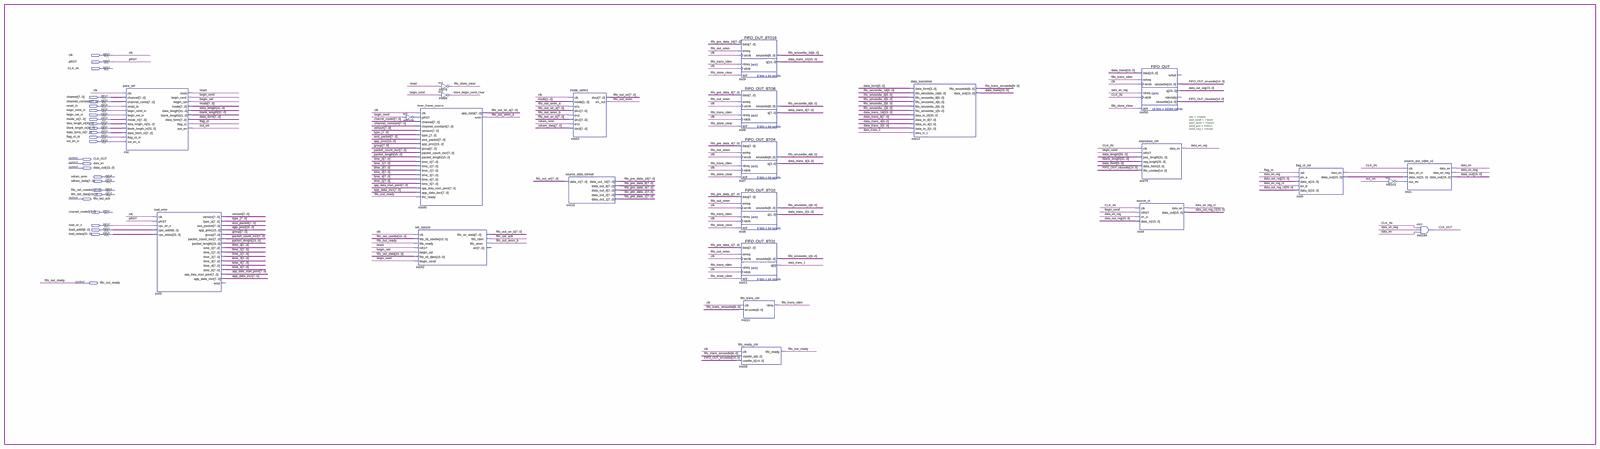
[diagram p0: schematic sheet, whole]
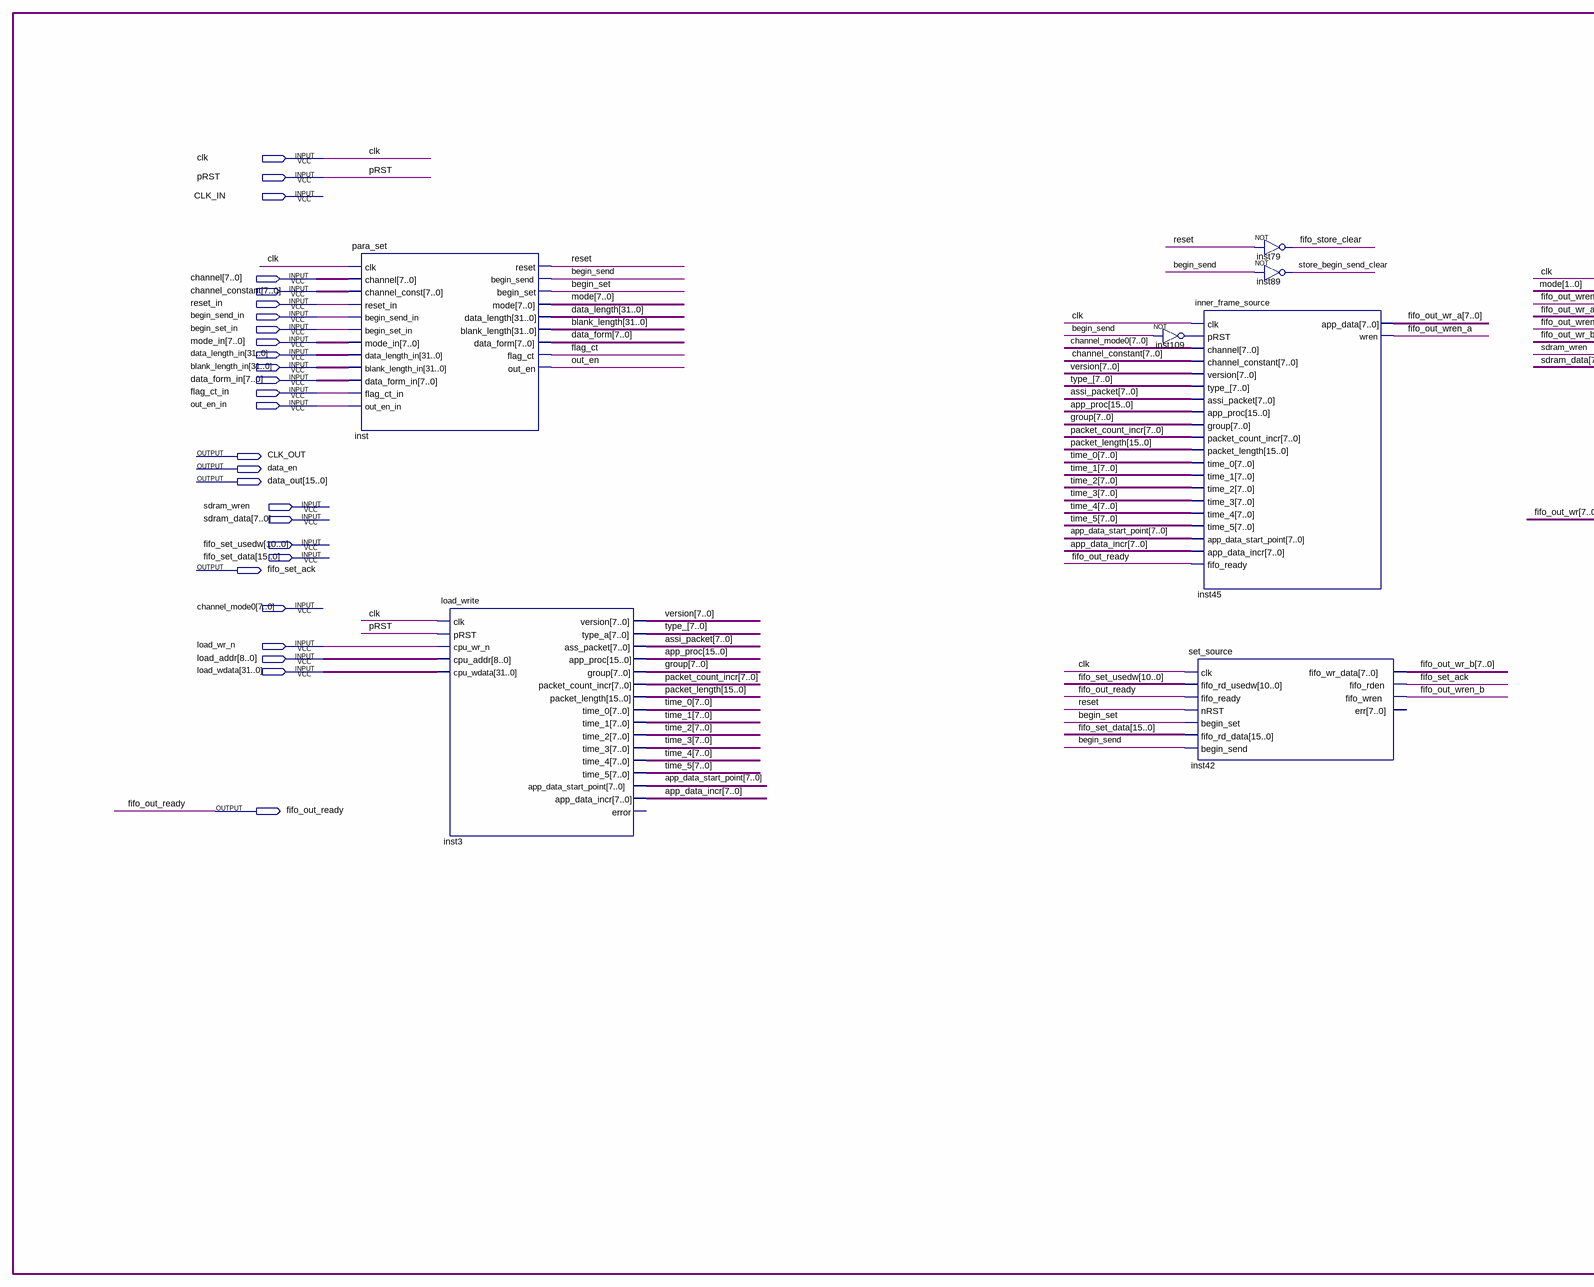
[diagram p1: schematic sheet, left part]
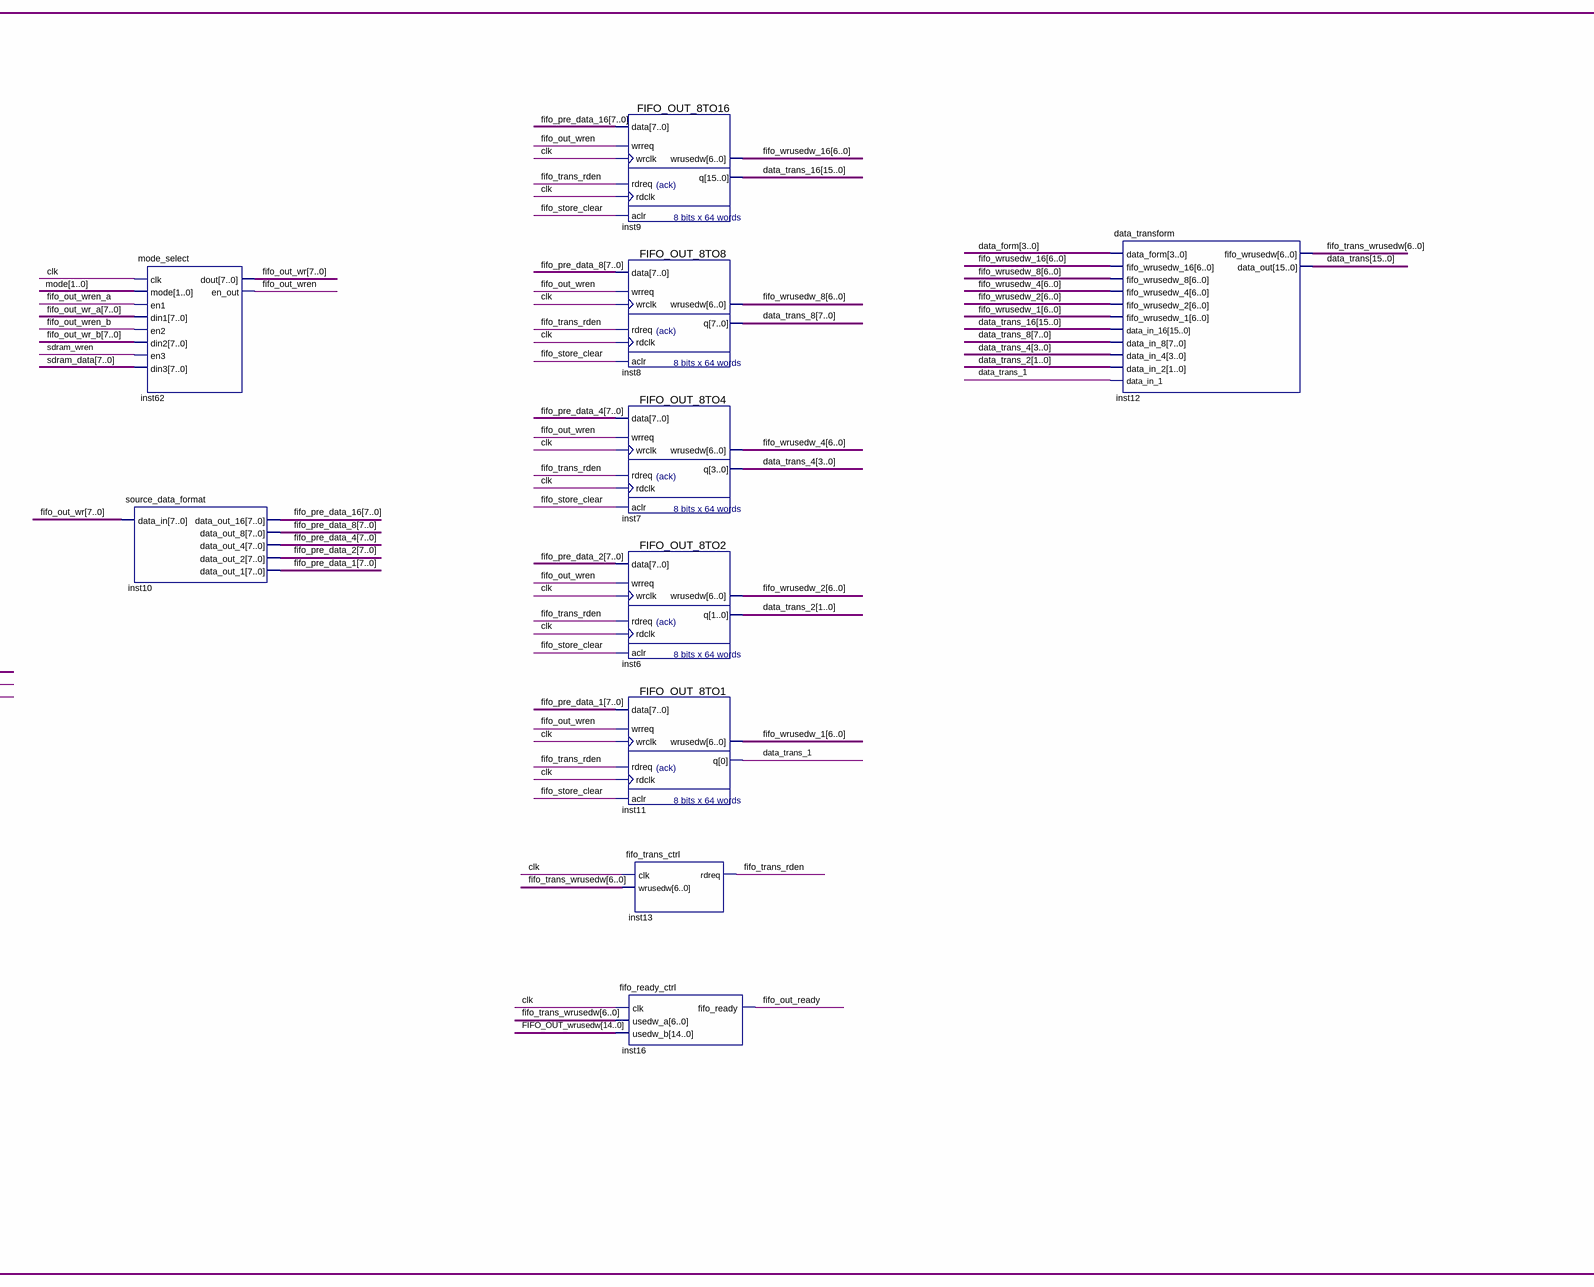
[diagram p2: schematic sheet, centre part]
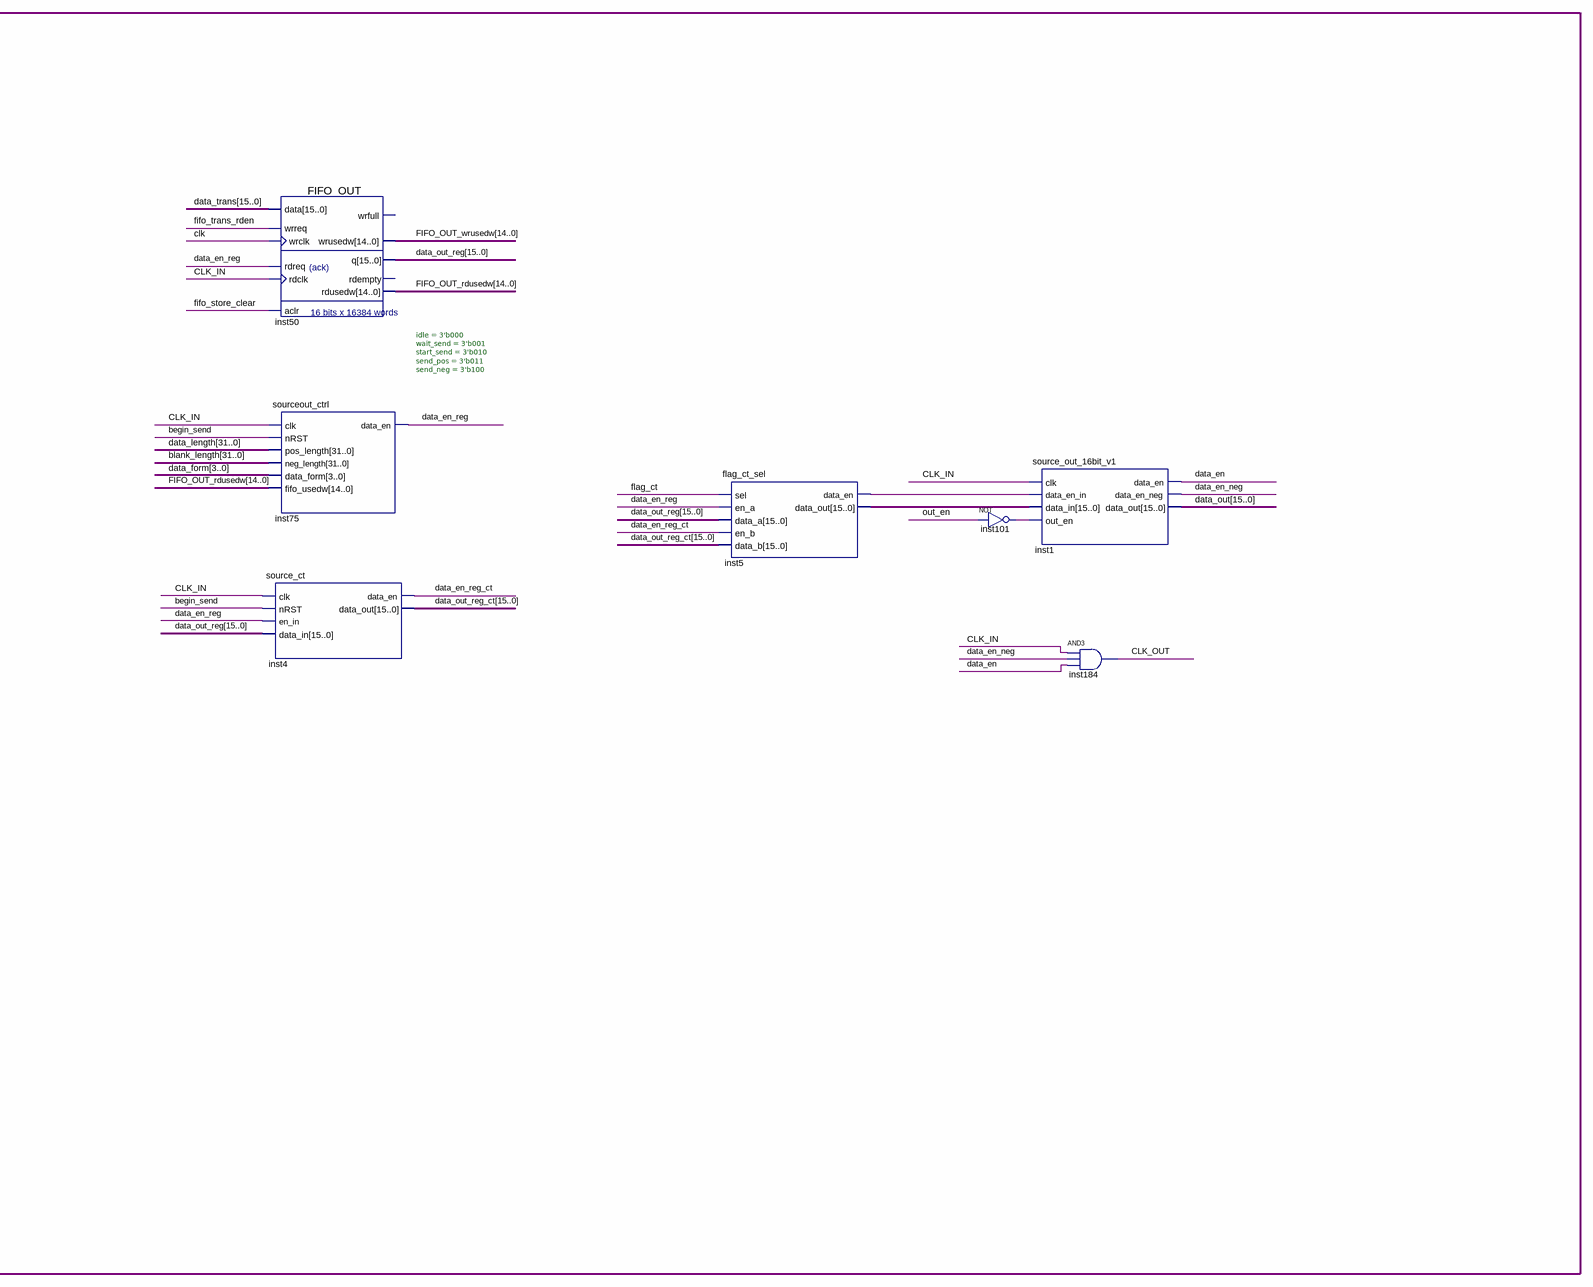
[diagram p3: schematic sheet, right part]
// Quartus schematic data_source_v1.bdf as structural Verilog: 24 symbols, 27 pins
module data_source_v1 (
  input  clk,
  input  pRST,
  input  CLK_IN,
  input  [7:0] channel,
  input  [7:0] channel_constant,
  input  reset_in,
  input  begin_send_in,
  input  begin_set_in,
  input  [7:0] mode_in,
  input  [31:0] data_length_in,
  input  [31:0] blank_length_in,
  input  [7:0] data_form_in,
  input  flag_ct_in,
  input  out_en_in,
  input  sdram_wren,
  input  [7:0] sdram_data,
  input  [10:0] fifo_set_usedw,
  input  [15:0] fifo_set_data,
  input  [7:0] channel_mode0,
  input  load_wr_n,
  input  [8:0] load_addr,
  input  [31:0] load_wdata,
  output CLK_OUT,
  output data_en,
  output [15:0] data_out,
  output fifo_set_ack,
  output fifo_out_ready
);

  wire begin_send, begin_set, data_en_neg, data_en_reg, data_en_reg_ct, data_trans_1, fifo_out_wren,
       fifo_out_wren_a, fifo_out_wren_b, fifo_store_clear, fifo_trans_rden, flag_ct, inst5_data_en,
       inst101_out, inst109_out, out_en, reset, store_begin_send_clear;
  wire [1:0] data_trans_2;
  wire [3:0] data_trans_4;
  wire [6:0] fifo_trans_wrusedw, fifo_wrusedw_1, fifo_wrusedw_2, fifo_wrusedw_4, fifo_wrusedw_8,
       fifo_wrusedw_16;
  wire [7:0] app_data_incr, app_data_start_point, assi_packet, data_form, data_trans_8, fifo_out_wr,
       fifo_out_wr_a, fifo_out_wr_b, fifo_pre_data_1, fifo_pre_data_2, fifo_pre_data_4, fifo_pre_data_8,
       fifo_pre_data_16, group, mode, packet_count_incr, time_0, time_1, time_2, time_3, time_4, time_5,
       type_, version;
  wire [14:0] FIFO_OUT_rdusedw, FIFO_OUT_wrusedw;
  wire [15:0] app_proc, data_out_reg, data_out_reg_ct, data_trans, data_trans_16, inst5_data_out,
       packet_length;
  wire [31:0] blank_length, data_length;

  para_set inst (
    .clk(clk), .channel(channel), .channel_const(channel_constant), .reset_in(reset_in),
    .begin_send_in(begin_send_in), .begin_set_in(begin_set_in), .mode_in(mode_in),
    .data_length_in(data_length_in), .blank_length_in(blank_length_in), .data_form_in(data_form_in),
    .flag_ct_in(flag_ct_in), .out_en_in(out_en_in), .reset(reset), .begin_send(begin_send),
    .begin_set(begin_set), .mode(mode), .data_length(data_length), .blank_length(blank_length),
    .data_form(data_form), .flag_ct(flag_ct), .out_en(out_en));
  load_write inst3 (
    .clk(clk), .pRST(pRST), .cpu_wr_n(load_wr_n), .cpu_addr(load_addr), .cpu_wdata(load_wdata),
    .version(version), .type_a(type_), .ass_packet(assi_packet), .app_proc(app_proc), .group(group),
    .packet_count_incr(packet_count_incr), .packet_length(packet_length), .time_0(time_0), .time_1(time_1),
    .time_2(time_2), .time_3(time_3), .time_4(time_4), .time_5(time_5),
    .app_data_start_point(app_data_start_point), .app_data_incr(app_data_incr));  // open: error
  not inst109 (inst109_out, begin_send);
  inner_frame_source inst45 (
    .clk(clk), .pRST(inst109_out), .channel(channel_mode0), .channel_constant(channel_constant),
    .version(version), .type_(type_), .assi_packet(assi_packet), .app_proc(app_proc), .group(group),
    .packet_count_incr(packet_count_incr), .packet_length(packet_length), .time_0(time_0), .time_1(time_1),
    .time_2(time_2), .time_3(time_3), .time_4(time_4), .time_5(time_5),
    .app_data_start_point(app_data_start_point), .app_data_incr(app_data_incr), .fifo_ready(fifo_out_ready),
    .app_data(fifo_out_wr_a), .wren(fifo_out_wren_a));
  set_source inst42 (
    .clk(clk), .fifo_rd_usedw(fifo_set_usedw), .fifo_ready(fifo_out_ready), .nRST(reset),
    .begin_set(begin_set), .fifo_rd_data(fifo_set_data), .begin_send(begin_send),
    .fifo_wr_data(fifo_out_wr_b), .fifo_rden(fifo_set_ack), .fifo_wren(fifo_out_wren_b));  // open: err
  not inst79 (fifo_store_clear, reset);
  not inst89 (store_begin_send_clear, begin_send);
  source_data_format inst10 (
    .data_in(fifo_out_wr), .data_out_16(fifo_pre_data_16), .data_out_8(fifo_pre_data_8),
    .data_out_4(fifo_pre_data_4), .data_out_2(fifo_pre_data_2), .data_out_1(fifo_pre_data_1));
  mode_select inst62 (
    .clk(clk), .mode(mode[1:0]), .en1(fifo_out_wren_a), .din1(fifo_out_wr_a), .en2(fifo_out_wren_b),
    .din2(fifo_out_wr_b), .en3(sdram_wren), .din3(sdram_data), .dout(fifo_out_wr), .en_out(fifo_out_wren));
  FIFO_OUT_8TO16 inst9 (
    .data(fifo_pre_data_16), .wrreq(fifo_out_wren), .wrclk(clk), .rdreq(fifo_trans_rden), .rdclk(clk),
    .aclr(fifo_store_clear), .wrusedw(fifo_wrusedw_16), .q(data_trans_16));
  FIFO_OUT_8TO8 inst8 (
    .data(fifo_pre_data_8), .wrreq(fifo_out_wren), .wrclk(clk), .rdreq(fifo_trans_rden), .rdclk(clk),
    .aclr(fifo_store_clear), .wrusedw(fifo_wrusedw_8), .q(data_trans_8));
  FIFO_OUT_8TO4 inst7 (
    .data(fifo_pre_data_4), .wrreq(fifo_out_wren), .wrclk(clk), .rdreq(fifo_trans_rden), .rdclk(clk),
    .aclr(fifo_store_clear), .wrusedw(fifo_wrusedw_4), .q(data_trans_4));
  FIFO_OUT_8TO2 inst6 (
    .data(fifo_pre_data_2), .wrreq(fifo_out_wren), .wrclk(clk), .rdreq(fifo_trans_rden), .rdclk(clk),
    .aclr(fifo_store_clear), .wrusedw(fifo_wrusedw_2), .q(data_trans_2));
  FIFO_OUT_8TO1 inst11 (
    .data(fifo_pre_data_1), .wrreq(fifo_out_wren), .wrclk(clk), .rdreq(fifo_trans_rden), .rdclk(clk),
    .aclr(fifo_store_clear), .wrusedw(fifo_wrusedw_1), .q(data_trans_1));
  fifo_trans_ctrl inst13 (.clk(clk), .wrusedw(fifo_trans_wrusedw), .rdreq(fifo_trans_rden));
  fifo_ready_ctrl inst16 (
    .clk(clk), .usedw_a(fifo_trans_wrusedw), .usedw_b(FIFO_OUT_wrusedw), .fifo_ready(fifo_out_ready));
  data_transform inst12 (
    .data_form(data_form[3:0]), .fifo_wrusedw_16(fifo_wrusedw_16), .fifo_wrusedw_8(fifo_wrusedw_8),
    .fifo_wrusedw_4(fifo_wrusedw_4), .fifo_wrusedw_2(fifo_wrusedw_2), .fifo_wrusedw_1(fifo_wrusedw_1),
    .data_in_16(data_trans_16), .data_in_8(data_trans_8), .data_in_4(data_trans_4), .data_in_2(data_trans_2),
    .data_in_1(data_trans_1), .fifo_wrusedw(fifo_trans_wrusedw), .data_out(data_trans));
  FIFO_OUT inst50 (
    .data(data_trans), .wrreq(fifo_trans_rden), .wrclk(clk), .rdreq(data_en_reg), .rdclk(CLK_IN),
    .aclr(fifo_store_clear), .wrusedw(FIFO_OUT_wrusedw), .q(data_out_reg), .rdusedw(FIFO_OUT_rdusedw));  // open: wrfull, rdempty
  sourceout_ctrl #(.idle(3'b000), .wait_send(3'b001), .start_send(3'b010), .send_pos(3'b011), .send_neg(3'b100)) inst75 (
    .clk(CLK_IN), .nRST(begin_send), .pos_length(data_length), .neg_length(blank_length),
    .data_form(data_form[3:0]), .fifo_usedw(FIFO_OUT_rdusedw), .data_en(data_en_reg));
  source_ct inst4 (
    .clk(CLK_IN), .nRST(begin_send), .en_in(data_en_reg), .data_in(data_out_reg), .data_en(data_en_reg_ct),
    .data_out(data_out_reg_ct));
  flag_ct_sel inst5 (
    .sel(flag_ct), .en_a(data_en_reg), .data_a(data_out_reg), .en_b(data_en_reg_ct),
    .data_b(data_out_reg_ct), .data_en(inst5_data_en), .data_out(inst5_data_out));
  not inst101 (inst101_out, out_en);
  source_out_16bit_v1 inst1 (
    .clk(CLK_IN), .data_en_in(inst5_data_en), .data_in(inst5_data_out), .out_en(inst101_out),
    .data_en(data_en), .data_en_neg(data_en_neg), .data_out(data_out));
  and inst184 (CLK_OUT, CLK_IN, data_en_neg, data_en);
endmodule
